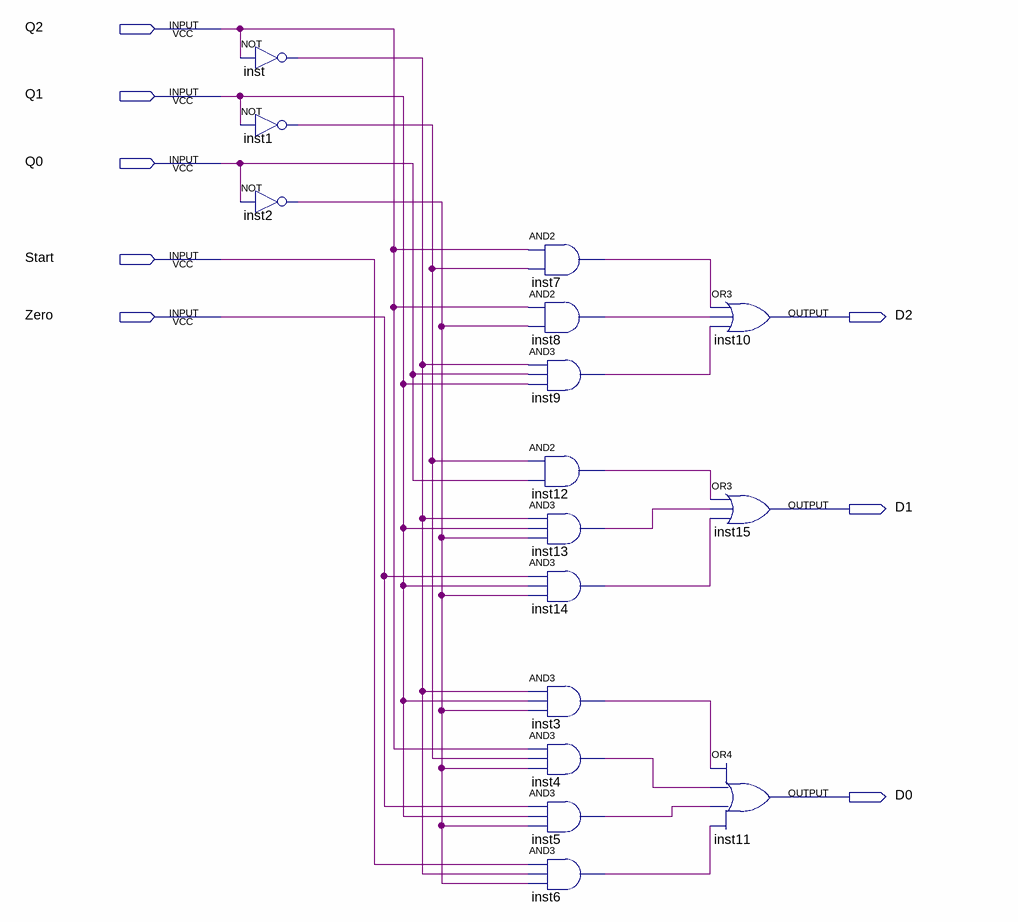
[diagram p0: schematic sheet]
// Quartus schematic D0_control_New.bdf as structural Verilog: 16 symbols, 8 pins
module D0_control_New (
  input  Q2,
  input  Q1,
  input  Q0,
  input  Start,
  input  Zero,
  output D2,
  output D1,
  output D0
);

  wire inst1_out, inst2_out, inst3_out, inst4_out, inst5_out, inst6_out, inst7_out, inst8_out, inst9_out,
       inst12_out, inst13_out, inst14_out, inst_out;

  not inst (inst_out, Q2);
  not inst1 (inst1_out, Q1);
  not inst2 (inst2_out, Q0);
  and inst7 (inst7_out, Q2, inst1_out);
  and inst8 (inst8_out, Q2, inst2_out);
  and inst9 (inst9_out, inst_out, Q0, Q1);
  and inst12 (inst12_out, inst1_out, Q0);
  and inst13 (inst13_out, inst_out, Q1, inst2_out);
  and inst14 (inst14_out, Zero, Q1, inst2_out);
  and inst3 (inst3_out, inst_out, Q1, inst2_out);
  and inst4 (inst4_out, Q2, inst1_out, inst2_out);
  and inst5 (inst5_out, Zero, Q1, inst2_out);
  and inst6 (inst6_out, Start, inst_out, inst2_out);
  or inst10 (D2, inst7_out, inst8_out, inst9_out);
  or inst15 (D1, inst12_out, inst13_out, inst14_out);
  or inst11 (D0, inst3_out, inst4_out, inst5_out, inst6_out);
endmodule
